# EasyEDA schematic SCH_Usbhub easyeda file.json
TITLE: Sheet_1; REV: 1.0; Date: 2025-10-07; Sheet: 1/1; Drawn By: shaur1021; Company: Your Company
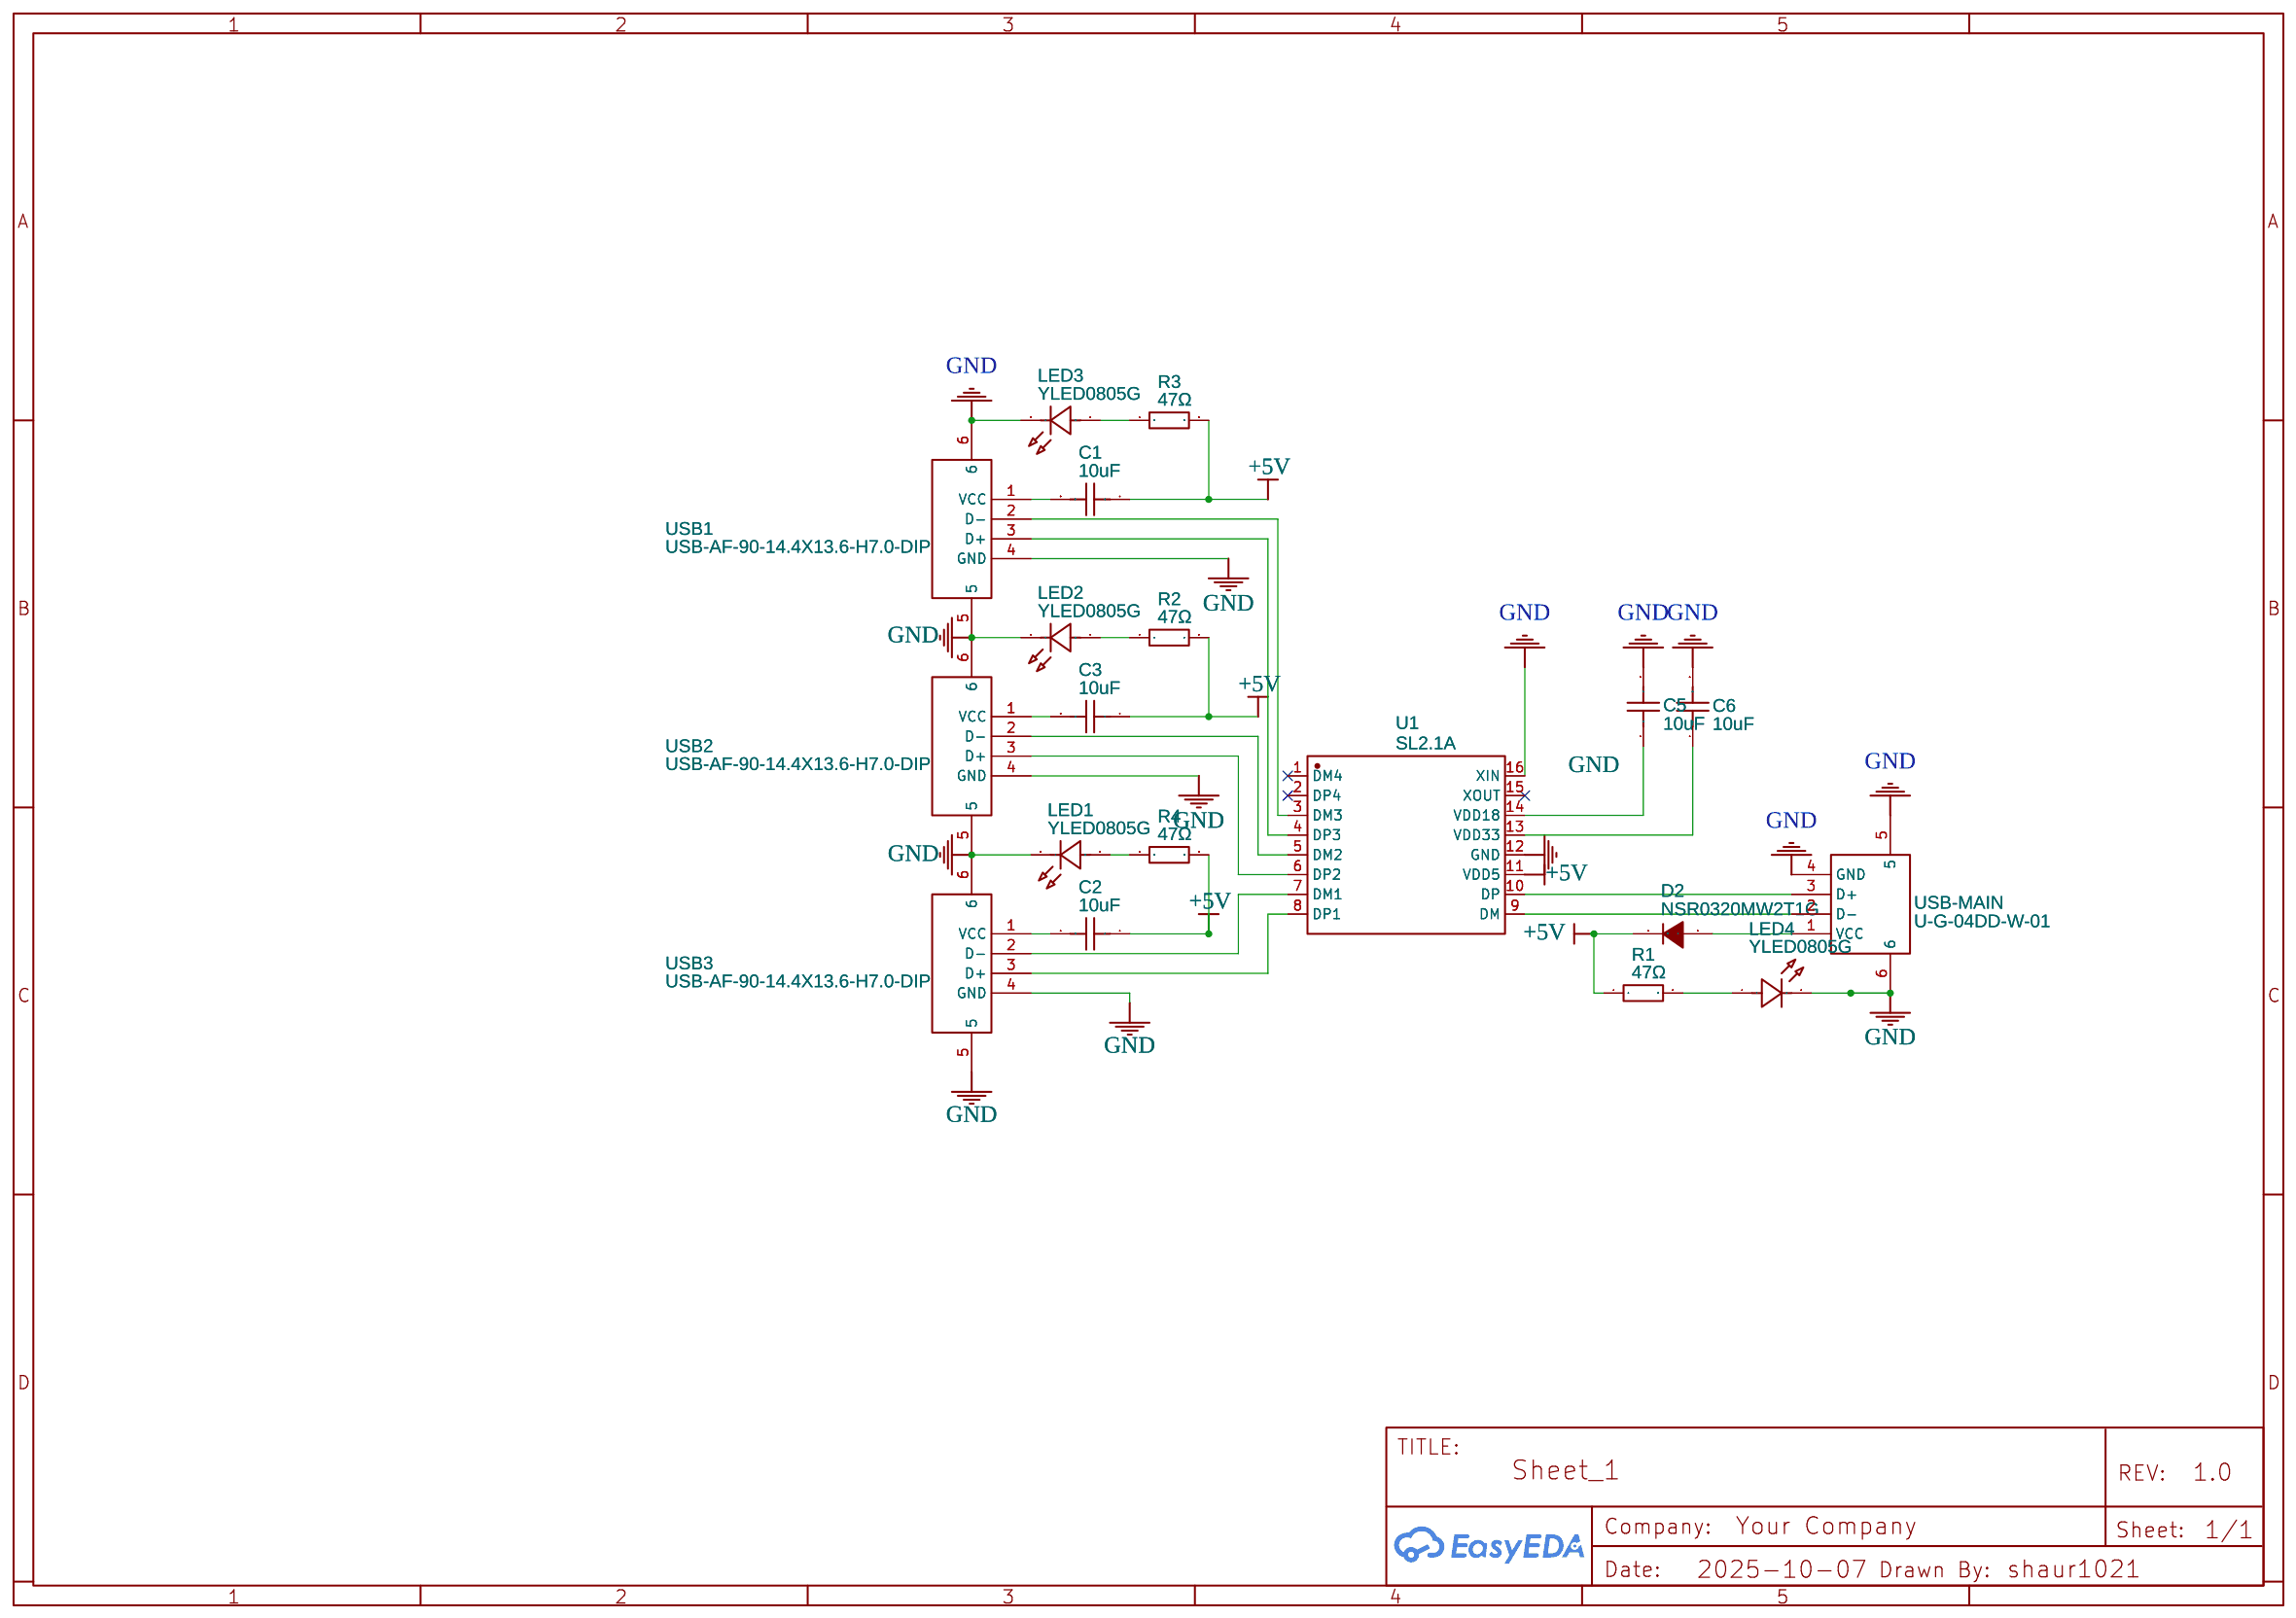
[diagram p0: schematic sheet]

## Parts
C1  10uF  [C0603]
C2  10uF  [C0603]
C3  10uF  [C0603]
C5  10uF  [C0603]
C6  10uF  [C0603]
D2  NSR0320MW2T1G  [SOD-323_L1.8-W1.3-LS2.5-RD]
LED1  YLED0805G  [LED0805-FD-GREEN]
LED2  YLED0805G  [LED0805-FD-GREEN]
LED3  YLED0805G  [LED0805-FD-GREEN]
LED4  YLED0805G  [LED0805-FD-GREEN]
R1  47Ω  [R0603]
R2  47Ω  [R0603]
R3  47Ω  [R0603]
R4  47Ω  [R0603]
U1  SL2.1A  [SOP-16_L10.0-W3.9-P1.27-LS6.0-BL]
USB1  USB-AF-90-14.4X13.6-H7.0-DIP  [USB-A-TH_C46407]
USB2  USB-AF-90-14.4X13.6-H7.0-DIP  [USB-A-TH_C46407]
USB3  USB-AF-90-14.4X13.6-H7.0-DIP  [USB-A-TH_C46407]
USB-MAIN  U-G-04DD-W-01  [USB-A-TH_U-G-04WD-W-01]

## Library data of the parts
C1-C3 C5 C6 = CL10A106KP8NNNC: Supplier: LCSC; Manufacturer: SAMSUNG(三星); Supplier Part: C19702; JLCPCB Part Class: Basic Part
D2 = NSR0320MW2T1G: Supplier: LCSC; Manufacturer: onsemi(安森美); Supplier Part: C48192; JLCPCB Part Class: Extended Part
LED1-LED4 = YLED0805G: Supplier: LCSC; Supplier Part: C25170728; Manufacturer: YONGYUTAI(永裕泰); Contributor: lcsc; JLCPCB Part Class: Extended Part
R1-R4 = 0603WAF470JT5E: Supplier: LCSC; Manufacturer: UNI-ROYAL(厚声); Supplier Part: C23182; JLCPCB Part Class: Basic Part
U1 = SL2.1A: Contributor: LCSC; Supplier: LCSC; Supplier Part: C192893; Manufacturer: CoreChips(和芯润德); JLCPCB Part Class: Extended Part
USB1-USB3 = USB-AF-90-14.4X13.6-H7.0-DIP: Contributor: LCSC; Supplier: LCSC; Supplier Part: C46407; Manufacturer: 精拓金; Manufacturer Part: 903-131A1011D10100; JLCPCB Part Class: Extended Part
USB-MAIN = U-G-04DD-W-01: Supplier: LCSC; Manufacturer: 韩国韩荣; Manufacturer Part: U-G-O4DD-W-1; Supplier Part: C98125; JLCPCB Part Class: Extended Part

## Nets
+5V: C1.1 C2.1 C3.1 D2.1(C) R1.1 R2.2 R3.2 R4.2 U1.11(VDD5)
GND: C5.2 C6.2 LED1.2(K) LED2.2(K) LED3.2(K) LED4.2(K) U1.12(GND) U1.16(XIN) USB1.4(GND) USB1.5 USB1.6 USB2.4(GND) USB2.5 USB2.6 USB3.4(GND) USB3.5 USB3.6 USB-MAIN.4(GND) USB-MAIN.5 USB-MAIN.6
Net-(C1-2): C1.2 USB1.1(VCC)
Net-(C2-2): C2.2 USB3.1(VCC)
Net-(C3-2): C3.2 USB2.1(VCC)
Net-(C5-1): C5.1 U1.14(VDD18)
Net-(C6-1): C6.1 U1.13(VDD33)
Net-(D2-2): D2.2(A) USB-MAIN.1(VCC)
Net-(LED1-1): LED1.1(A) R4.1
Net-(LED2-1): LED2.1(A) R2.1
Net-(LED3-1): LED3.1(A) R3.1
Net-(LED4-1): LED4.1(A) R1.2
Net-(U1-3): U1.3(DM3) USB1.2(D-)
Net-(U1-4): U1.4(DP3) USB1.3(D+)
Net-(U1-5): U1.5(DM2) USB2.2(D-)
Net-(U1-6): U1.6(DP2) USB2.3(D+)
Net-(U1-7): U1.7(DM1) USB3.2(D-)
Net-(U1-8): U1.8(DP1) USB3.3(D+)
Net-(U1-9): U1.9(DM) USB-MAIN.2(D-)
Net-(U1-10): U1.10(DP) USB-MAIN.3(D+)

Not connected (* = marked no-connect by the designer): U1 1(DM4)* 2(DP4)* 15(XOUT)*
